# Altium schematic sheet 3_cyber60-mxhs_mcu.SchDoc: =ProjectTitle
size A4; Address1: github.com/4pplet/cyber60; Address2: Licence: CERN-OHL-S; SheetNumber: 3; SheetTotal: 5
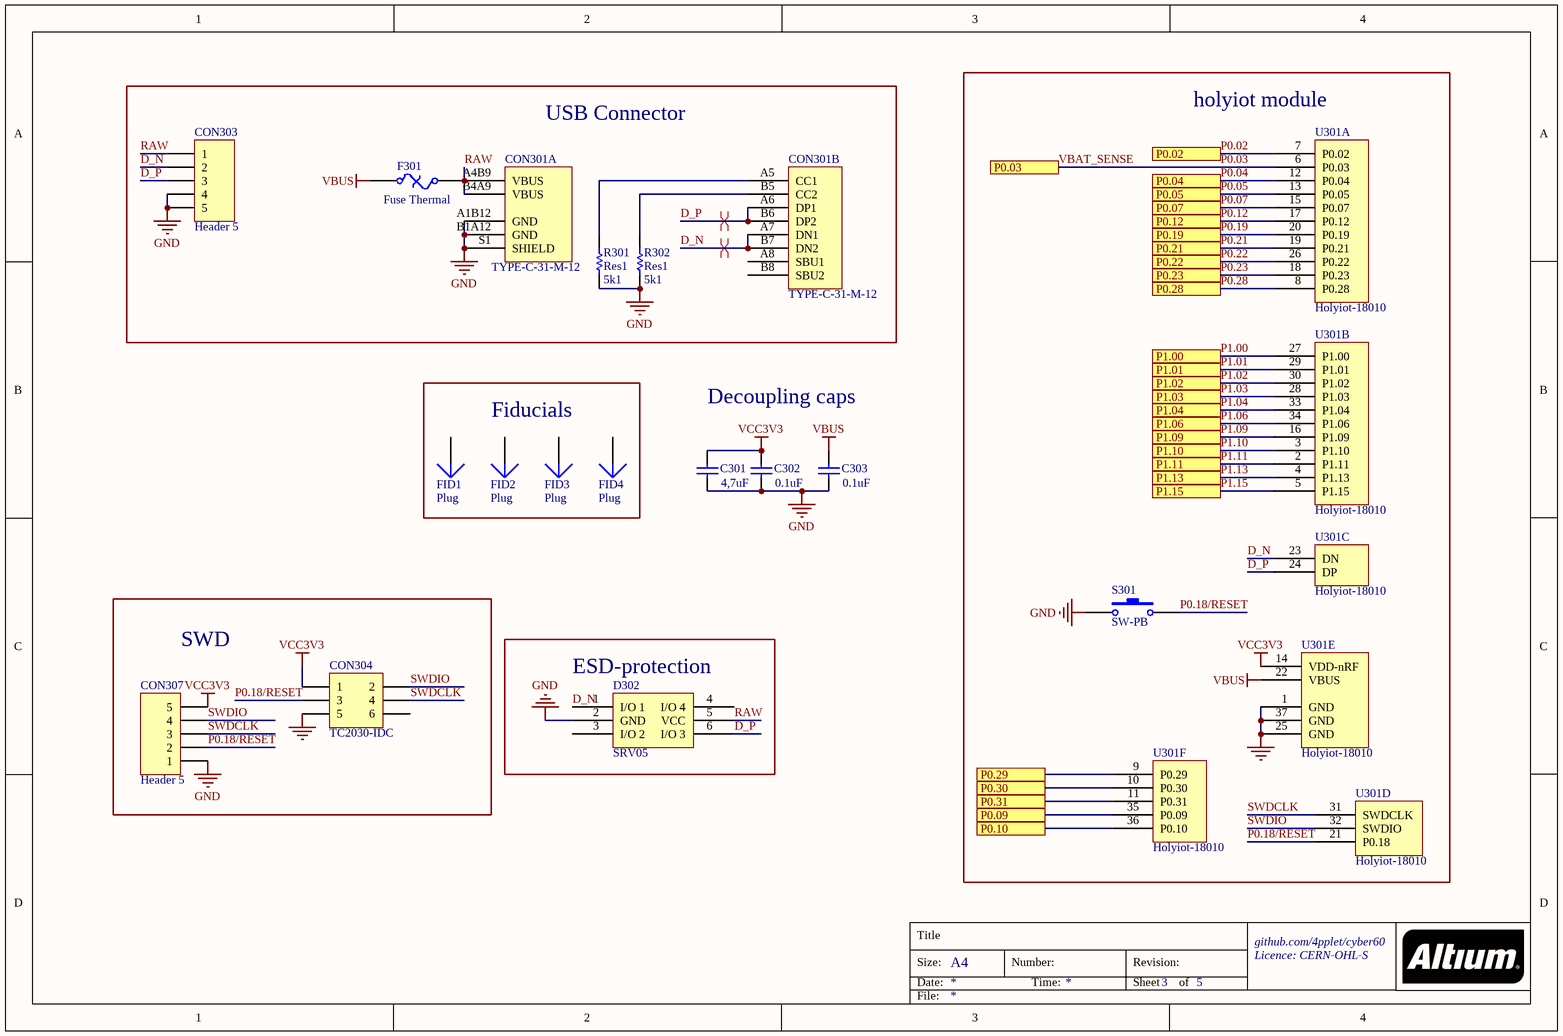
[diagram p0: 3_cyber60-mxhs_mcu.SchDoc]

## Parts
C301  value 4,7uF  [C0603[1608]]
C302  value 0.1uF  [C0603[1608]]
C303  value 0.1uF  [C0603[1608]]
CON301  TYPE-C-31-M-12  [TYPE-C-31-M-12]  (parts A,B of 2)
CON303  Header 5  [JST SM04B-SRSS-TB]
CON304  TC2030-IDC  [TC2030-IDC-NL]  (no BOM)
CON307  Header 5  [HDR1X5]  (no BOM)
D302  SRV05  [SOT-23-6]
F301  Fuse Thermal  [C1206[3216]]
FID1  Plug  [Fiducial_Nordic]  (no BOM)
FID2  Plug  [Fiducial_Nordic]  (no BOM)
FID3  Plug  [Fiducial_Nordic]  (no BOM)
FID4  Plug  [Fiducial_Nordic]  (no BOM)
R301  Res1  value 5k1  [R0603[1608]]
R302  Res1  value 5k1  [R0603[1608]]
S301  SW-PB  [XKB Switch]
U301  Holyiot-18010  [Holyiot-18010 - outer pads]  (parts A,B,C,D,E,F of 6)

## Blocks framed on the sheet
USB Connector: CON301 CON303 F301 R301 R302
holyiot module: S301 U301
Fiducials: FID1-FID4
SWD: CON304 CON307
ESD-protection: D302

## Ports
P0.02, P0.03, P0.04, P0.05, P0.07, P0.09, P0.10, P0.12, P0.19, P0.21, P0.22, P0.23, P0.28, P0.29, P0.30, P0.31, P1.00, P1.01, P1.02, P1.03, P1.04, P1.06, P1.09, P1.10, P1.11, P1.13, P1.15

## Nets
GND: C301.1 C302.1 C303.1 CON301.A1B12(GND) CON301.B1A12(GND) CON301.S1(SHIELD) CON303.4 CON303.5 CON304.5 CON307.1 D302.2(GND) R301.2 R302.2 S301.1 U301.1(GND) U301.25(GND) U301.37(GND)
VBUS: C303.2 F301.1 U301.22(VBUS)
VCC3V3: C301.2 C302.2 CON304.1 CON307.5 U301.14(VDD-nRF)
D_N: CON301.A7(DN1) CON301.B7(DN2) CON303.2 D302.1(I/O_1) U301.23(DN)
D_P: CON301.A6(DP1) CON301.B6(DP2) CON303.3 D302.6(I/O_3) U301.24(DP)
P0.02: U301.7(P0.02) ; port P0.02
P0.03: U301.6(P0.03) ; port P0.03  [also labelled VBAT_SENSE]
P0.04: U301.12(P0.04) ; port P0.04
P0.05: U301.13(P0.05) ; port P0.05
P0.07: U301.15(P0.07) ; port P0.07
P0.09: U301.35(P0.09) ; port P0.09
P0.10: U301.36(P0.10) ; port P0.10
P0.12: U301.17(P0.12) ; port P0.12
P0.18/RESET: CON304.3 CON307.2 S301.2 U301.21(P0.18)
P0.19: U301.20(P0.19) ; port P0.19
P0.21: U301.19(P0.21) ; port P0.21
P0.22: U301.26(P0.22) ; port P0.22
P0.23: U301.18(P0.23) ; port P0.23
P0.28: U301.8(P0.28) ; port P0.28
P0.29: U301.9(P0.29) ; port P0.29
P0.30: U301.10(P0.30) ; port P0.30
P0.31: U301.11(P0.31) ; port P0.31
P1.00: U301.27(P1.00) ; port P1.00
P1.01: U301.29(P1.01) ; port P1.01
P1.02: U301.30(P1.02) ; port P1.02
P1.03: U301.28(P1.03) ; port P1.03
P1.04: U301.33(P1.04) ; port P1.04
P1.06: U301.34(P1.06) ; port P1.06
P1.09: U301.16(P1.09) ; port P1.09
P1.10: U301.3(P1.10) ; port P1.10
P1.11: U301.2(P1.11) ; port P1.11
P1.13: U301.4(P1.13) ; port P1.13
P1.15: U301.5(P1.15) ; port P1.15
RAW: CON301.A4B9(VBUS) CON301.B4A9(VBUS) CON303.1 D302.5(VCC) F301.2
SWDCLK: CON304.4 CON307.3 U301.31(SWDCLK)
SWDIO: CON304.2 CON307.4 U301.32(SWDIO)
NetCON301_A5: CON301.A5(CC1) R301.1
NetCON301_B5: CON301.B5(CC2) R302.1

Not connected (* = marked no-connect by the designer): CON301 A8(SBU1) B8(SBU2); CON304 6; D302 3(I/O_2) 4(I/O_4); FID1 1; FID2 1; FID3 1; FID4 1

## Layout directives
differential pair: D_N, D_P

## Notes on the sheet
- Decoupling caps
- Title
- Size:
- Date:
- A4
- Number:
- Time:
- Revision:
- Sheet
- of
- File:

## Library data of the parts
C301 = Cap: Capacitor; MRF.Part: CL10A475KO8NNNC; LCSC MFG: Samsung Electro-Mechanics; LCSC Part #: C19666
C302 C303 = Cap: Capacitor; MRF.Part: CC0603KRX7R9BB104; MFG: KEMET; MFGPN: C0603C104M5RACTU; LCSC MFG: YAGEO; Version: 0603 imperial; LCSC Part #: C14663
CON301 = TYPE-C-31-M-12: MFG: Korean Hroparts Elec; MFGPN: TYPE-C-31-M-12; LCSC Part #: C165948; LCSC MFG: Korean Hroparts Elec; MRF.Part: TYPE-C-31-M-12
CON303 = Header 5: JST for USB daughter board; MFGPN: SM04B-SRSS-TB(LF)(SN); MFG: JST Sales America Inc.; LCSC MFG: JST Sales America; LCSC Part #: C160404; MRF.Part: SM04B-SRSS-TB(LF)(SN)
CON304 = Header 3X2: Header, 3-Pin, Dual row
CON307 = Header 5: Header, 5-Pin
D302 = SRV05: MRF.Part: SRV05-4-P-T7; LCSC MFG: ProTek Devices; LCSC Part #: C85364
F301 = Fuse Thermal: Thermal Fuse; MRF.Part: ASMD1206-050; MFG: Bel Fuse Inc.; MFGPN: 0ZCJ0050FF2G; LCSC MFG: Shenzhen JDT Fuse; LCSC Part #: C135338
R301 R302 = Res1: Resistor; MRF.Part: 0603WAF5101T5E; MFG: Panasonic Electronic Components; MFGPN: ERJ-3EKF5101V; LCSC MFG: Uniroyal Elec; Version: 0603 imperial; LCSC Part #: C23186
S301 = SW-PB: Switch; MRF.Part: TS-1187A-C-D-B; MFGPN: PTS645SM43SMTR92 LFS; MFG: C&K; LCSC MFG: XKB Enterprise; LCSC Part #: C318888
U301 = Holyiot-18010: MFGPN: 18010; MFG: HolyIOT